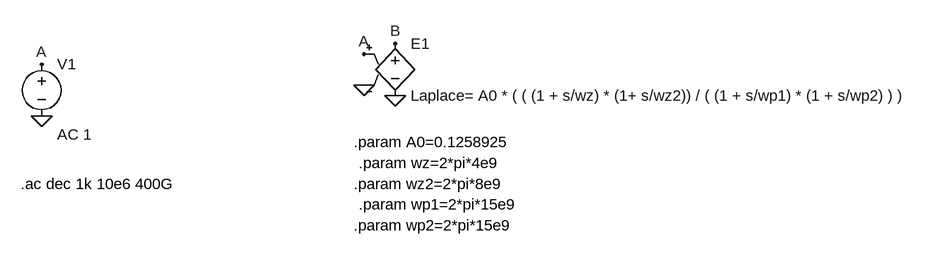
[diagram p0: schematic laplace.asc]
laplace.asc, the LTspice schematic file:
Version 4
SHEET 1 1452 680
FLAG -16 176 0
FLAG -16 96 A
FLAG 480 128 0
FLAG 480 80 A
FLAG 528 144 0
FLAG 528 64 B
SYMBOL voltage -16 80 R0
WINDOW 123 24 124 Left 2
WINDOW 39 0 0 Left 0
SYMATTR Value2 AC 1
SYMATTR InstName V1
SYMATTR Value ""
SYMBOL e 528 48 R0
SYMATTR InstName E1
SYMATTR Value Laplace= A0 * ( ( (1 + s/wz) * (1+ s/wz2)) / ( (1 + s/wp1) * (1 + s/wp2) ) )
TEXT -48 280 Left 2 !.ac dec 1k 10e6 400G
TEXT 464 216 Left 2 !.param A0=0.1258925
TEXT 472 248 Left 2 !.param wz=2*pi*4e9
TEXT 464 280 Left 2 !.param wz2=2*pi*8e9
TEXT 472 312 Left 2 !.param wp1=2*pi*15e9
TEXT 464 344 Left 2 !.param wp2=2*pi*15e9

The netlist it stands for:
* laplace.asc
V1 A 0 AC 1
E1 B 0 A 0 Laplace= A0 * ( ( (1 + s/wz) * (1+ s/wz2)) / ( (1 + s/wp1) * (1 + s/wp2) ) )
.ac dec 1k 10e6 400G
.param A0=0.1258925
.param wz=2*pi*4e9
.param wz2=2*pi*8e9
.param wp1=2*pi*15e9
.param wp2=2*pi*15e9
.backanno
.end